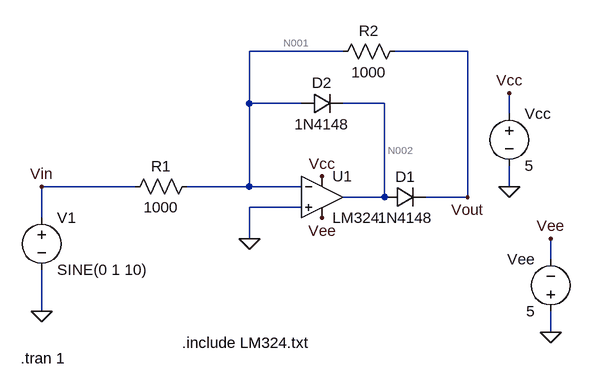
[diagram p0: schematic LM324_SuperDiode_Improved.asc]
LM324_SuperDiode_Improved.asc, the LTspice schematic file:
Version 4
SHEET 1 880 680
WIRE 224 -80 80 -80
WIRE 416 -80 304 -80
WIRE 80 0 80 -80
WIRE 160 0 80 0
WIRE 288 0 224 0
WIRE 480 16 480 -16
WIRE -96 128 -240 128
WIRE 80 128 80 0
WIRE 80 128 -16 128
WIRE 160 128 80 128
WIRE 480 128 480 96
WIRE 288 144 288 0
WIRE 288 144 224 144
WIRE 416 144 416 -80
WIRE 416 144 352 144
WIRE 160 160 80 160
WIRE -240 176 -240 128
WIRE 80 208 80 160
WIRE 544 240 544 208
WIRE -240 320 -240 256
WIRE 544 352 544 320
FLAG -240 320 0
FLAG 480 -16 Vcc
FLAG 480 128 0
FLAG 544 352 0
FLAG 544 208 Vee
FLAG 192 176 Vee
FLAG 192 112 Vcc
FLAG -240 128 Vin
FLAG 416 144 Vout
FLAG 80 208 0
SYMBOL voltage -240 160 R0
WINDOW 123 0 0 Left 0
WINDOW 39 0 0 Left 0
SYMATTR InstName V1
SYMATTR Value SINE(0 1 10)
SYMBOL voltage 480 0 R0
WINDOW 123 0 0 Left 0
WINDOW 39 0 0 Left 0
SYMATTR InstName Vcc
SYMATTR Value 5
SYMBOL voltage 544 336 R180
WINDOW 0 24 96 Left 2
WINDOW 3 24 16 Left 2
WINDOW 123 0 0 Left 0
WINDOW 39 0 0 Left 0
SYMATTR InstName Vee
SYMATTR Value 5
SYMBOL OpAmps\\opamp2 192 80 R0
SYMATTR InstName U1
SYMATTR Value LM324
SYMBOL diode 288 160 R270
WINDOW 0 32 32 VTop 2
WINDOW 3 0 32 VBottom 2
SYMATTR InstName D1
SYMATTR Value 1N4148
SYMBOL diode 160 16 R270
WINDOW 0 32 32 VTop 2
WINDOW 3 0 32 VBottom 2
SYMATTR InstName D2
SYMATTR Value 1N4148
SYMBOL res 0 112 R90
WINDOW 0 0 56 VBottom 2
WINDOW 3 32 56 VTop 2
SYMATTR InstName R1
SYMATTR Value 1000
SYMBOL res 320 -96 R90
WINDOW 0 0 56 VBottom 2
WINDOW 3 32 56 VTop 2
SYMATTR InstName R2
SYMATTR Value 1000
TEXT -24 368 Left 2 !.include LM324.txt
TEXT -272 392 Left 2 !.tran 1

The netlist it stands for:
* LM324_SuperDiode_Improved.asc
V1 Vin 0 SINE(0 1 10)
Vcc Vcc 0 5
Vee 0 Vee 5
XU1 0 N001 Vcc Vee N002 LM324  ; pins In+ In- V+ V- OUT
D1 N002 Vout 1N4148
D2 N001 N002 1N4148
R1 N001 Vin 1000
R2 Vout N001 1000
.model D D
.lib standard.dio
.include LM324.txt
.tran 1
.backanno
.end

* Results of the author's LTspice run, read from the files saved beside the schematic
* Operating Point, zero values left out:
*   V(vcc) = 5 V
*   V(vee) = -5 V
*   V(n002) = -137.5 mV
*   V(n001) = -32.27 µV
*   V(vout) = -34.67 µV
*   I(D2) = 49.82 nA
*   I(D1) = -2.399 nA
*   I(R2) = -2.399 nA
*   I(R1) = -32.27 nA
*   I(Vee) = -339.9 µA
*   I(Vcc) = -340 µA
*   I(V1) = -32.27 nA
*   Ix(u1:1) = -19.93 nA
*   Ix(u1:2) = -19.94 nA
*   Ix(u1:3) = 340 µA
*   Ix(u1:4) = -339.9 µA
*   Ix(u1:5) = 52.22 nA
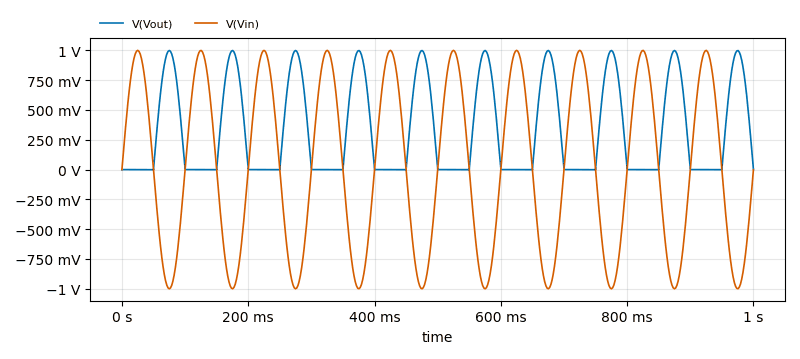
[diagram p1: Transient Analysis of LM324_SuperDiode_Improved.asc, plotted from the saved traces]
* Transient Analysis, 1 run:
*   V(Vout): min -2.307 mV, max 998.9 mV, average 317.5 mV, rms 499.3 mV, last 990.8 µV
*   V(Vin): min -1 V, max 1 V, average 1.411 µV, rms 706.9 mV, last 0 V